# Altium schematic sheet Sheet1.SchDoc: SqueakyBoard
size A
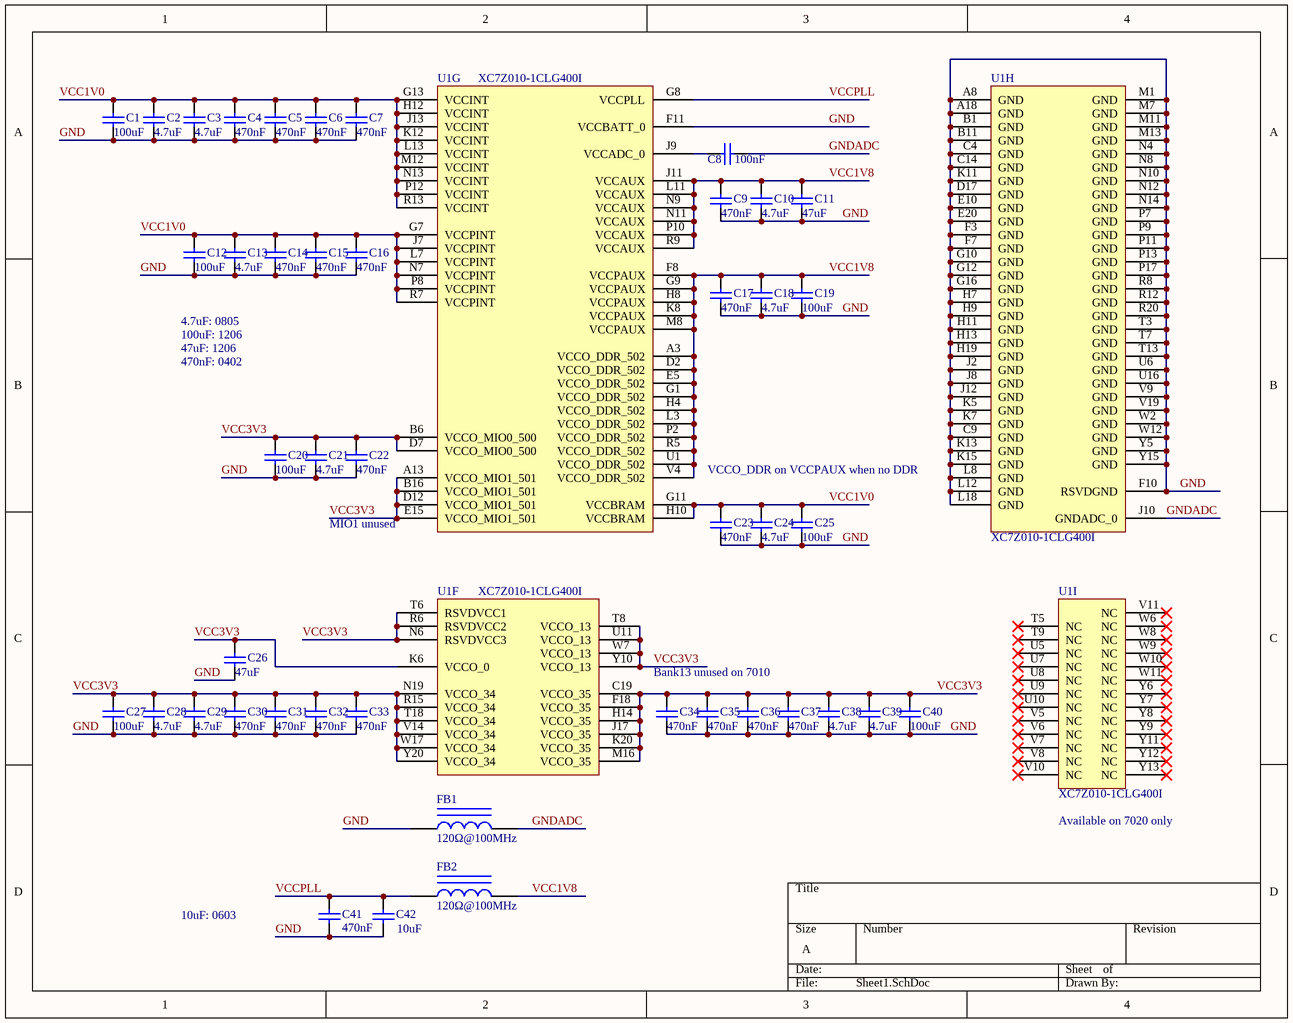
[diagram p0: Sheet1.SchDoc]

## Parts
C1  100uF  [1206_C]
C2  4.7uF  [0805_C]
C3  4.7uF  [0805_C]
C4  470nF  [0402_C]
C5  470nF  [0402_C]
C6  470nF  [0402_C]
C7  470nF  [0402_C]
C8  100nF  [1206_C]
C9  470nF  [0402_C]
C10  4.7uF  [0805_C]
C11  47uF  [1206_C]
C12  100uF  [1206_C]
C13  4.7uF  [0805_C]
C14  470nF  [0402_C]
C15  470nF  [0402_C]
C16  470nF  [0402_C]
C17  470nF  [0402_C]
C18  4.7uF  [0805_C]
C19  100uF  [1206_C]
C20  100uF  [1206_C]
C21  4.7uF  [0805_C]
C22  470nF  [0402_C]
C23  470nF  [0402_C]
C24  4.7uF  [0805_C]
C25  100uF  [1206_C]
C26  47uF  [1206_C]
C27  100uF  [1206_C]
C28  4.7uF  [0805_C]
C29  4.7uF  [0805_C]
C30  470nF  [0402_C]
C31  470nF  [0402_C]
C32  470nF  [0402_C]
C33  470nF  [0402_C]
C34  470nF  [0402_C]
C35  470nF  [0402_C]
C36  470nF  [0402_C]
C37  470nF  [0402_C]
C38  4.7uF  [0805_C]
C39  4.7uF  [0805_C]
C40  100uF  [1206_C]
C41  470nF  [0402_C]
C42  10uF  [0603_C]
FB1  120Ω@100MHz  [0805_L]
FB2  120Ω@100MHz  [0805_L]
U1  XC7Z010-1CLG400I  [CLG400]  (parts F,G,H,I of 9)

## Nets
GND: C1.2 C2.2 C3.2 C4.2 C5.2 C6.2 C7.2 C9.1 C10.1 C11.1 C12.2 C13.2 C14.2 C15.2 C16.2 C17.1 C18.1 C19.1 C20.2 C21.2 C22.2 C23.1 C24.1 C25.1 C26.1 C27.2 C28.2 C29.2 C30.2 C31.2 C32.2 C33.2 C34.2 C35.2 C36.2 C37.2 C38.2 C39.2 C40.2 C41.1 C42.1 FB1.1 U1.A8(GND) U1.A18(GND) U1.B1(GND) U1.B11(GND) U1.C4(GND) U1.C9(GND) U1.C14(GND) U1.D17(GND) U1.E10(GND) U1.E20(GND) U1.F3(GND) U1.F7(GND) U1.F10(RSVDGND) U1.F11(VCCBATT_0) U1.G10(GND) U1.G12(GND) U1.G16(GND) U1.H7(GND) U1.H9(GND) U1.H11(GND) U1.H13(GND) U1.H19(GND) U1.J2(GND) U1.J8(GND) U1.J12(GND) U1.K5(GND) U1.K7(GND) U1.K11(GND) U1.K13(GND) U1.K15(GND) U1.L8(GND) U1.L12(GND) U1.L18(GND) U1.M1(GND) U1.M7(GND) U1.M11(GND) U1.M13(GND) U1.N4(GND) U1.N8(GND) U1.N10(GND) U1.N12(GND) U1.N14(GND) U1.P7(GND) U1.P9(GND) U1.P11(GND) U1.P13(GND) U1.P17(GND) U1.R8(GND) U1.R12(GND) U1.R20(GND) U1.T3(GND) U1.T7(GND) U1.T13(GND) U1.U6(GND) U1.U16(GND) U1.V9(GND) U1.V19(GND) U1.W2(GND) U1.W12(GND) U1.Y5(GND) U1.Y15(GND)
GNDADC: C8.2 FB1.2 U1.J10(GNDADC_0)
VCC1V0: C1.1 C2.1 C3.1 C4.1 C5.1 C6.1 C7.1 C12.1 C13.1 C14.1 C15.1 C16.1 C23.2 C24.2 C25.2 U1.G7(VCCPINT) U1.G11(VCCBRAM) U1.G13(VCCINT) U1.H10(VCCBRAM) U1.H12(VCCINT) U1.J7(VCCPINT) U1.J13(VCCINT) U1.K12(VCCINT) U1.L7(VCCPINT) U1.L13(VCCINT) U1.M12(VCCINT) U1.N7(VCCPINT) U1.N13(VCCINT) U1.P8(VCCPINT) U1.P12(VCCINT) U1.R7(VCCPINT) U1.R13(VCCINT)
VCC1V8: C9.2 C10.2 C11.2 C17.2 C18.2 C19.2 FB2.2 U1.A3(VCCO_DDR_502) U1.D2(VCCO_DDR_502) U1.E5(VCCO_DDR_502) U1.F8(VCCPAUX) U1.G1(VCCO_DDR_502) U1.G9(VCCPAUX) U1.H4(VCCO_DDR_502) U1.H8(VCCPAUX) U1.J11(VCCAUX) U1.K8(VCCPAUX) U1.L3(VCCO_DDR_502) U1.L11(VCCAUX) U1.M8(VCCPAUX) U1.N9(VCCAUX) U1.N11(VCCAUX) U1.P2(VCCO_DDR_502) U1.P10(VCCAUX) U1.R5(VCCO_DDR_502) U1.R9(VCCAUX) U1.U1(VCCO_DDR_502) U1.V4(VCCO_DDR_502)
VCC3V3: C20.1 C21.1 C22.1 C26.2 C27.1 C28.1 C29.1 C30.1 C31.1 C32.1 C33.1 C34.1 C35.1 C36.1 C37.1 C38.1 C39.1 C40.1 U1.A13(VCCO_MIO1_501) U1.B6(VCCO_MIO0_500) U1.B16(VCCO_MIO1_501) U1.C19(VCCO_35) U1.D7(VCCO_MIO0_500) U1.D12(VCCO_MIO1_501) U1.E15(VCCO_MIO1_501) U1.F18(VCCO_35) U1.H14(VCCO_35) U1.J17(VCCO_35) U1.K6(VCCO_0) U1.K20(VCCO_35) U1.M16(VCCO_35) U1.N6(RSVDVCC3) U1.N19(VCCO_34) U1.R6(RSVDVCC2) U1.R15(VCCO_34) U1.T6(RSVDVCC1) U1.T8(VCCO_13) U1.T18(VCCO_34) U1.U11(VCCO_13) U1.V14(VCCO_34) U1.W7(VCCO_13) U1.W17(VCCO_34) U1.Y10(VCCO_13) U1.Y20(VCCO_34)
VCCPLL: C41.2 C42.2 FB2.1 U1.G8(VCCPLL)
NetC8_1: C8.1 U1.J9(VCCADC_0)

Not connected (* = marked no-connect by the designer): U1 T5(NC)* T9(NC)* U5(NC)* U7(NC)* U8(NC)* U9(NC)* U10(NC)* V5(NC)* V6(NC)* V7(NC)* V8(NC)* V10(NC)* V11(NC)* W6(NC)* W8(NC)* W9(NC)* W10(NC)* W11(NC)* Y6(NC)* Y7(NC)* Y8(NC)* Y9(NC)* Y11(NC)* Y12(NC)* Y13(NC)*

## Notes on the sheet
- 4.7uF: 0805
- 100uF: 1206
- 47uF: 1206
- 470nF: 0402
- VCCO_DDR on VCCPAUX when no DDR
- MIO1 unused
- Bank13 unused on 7010
- (near U1) Available on 7020 only
- 10uF: 0603
- Title
- Size:
- Date:
- A
- Number:
- Time:
- Revision:
- Sheet
- of
- File:

## Library data of the parts
C1 C11 C12 C19 C20 C25-C27 C40 = 1206 10uF (106) 10% 50V: 贴片电容; ComponentLink1Description: 供应商链接; ComponentLink1URL: http://www.szlcsc.com/product/details_14236.html; Package: 1206; Supplier: LC; SuppliersPartNumber: C13585
C2 C3 C10 C13 C18 C21 C24 C28 C29 C38 C39 = 0805 4.7uF (475) 10% 25V: 贴片电容; ComponentLink1Description: 供应商链接; ComponentLink1URL: http://www.szlcsc.com/product/details_2131.html; Package: 0805; Supplier: LC; SuppliersPartNumber: C1779
C4-C7 C9 C14-C17 C22 C23 C30-C37 C41 = 0402 470nF (474) 10% 10V: 贴片电容; ComponentLink1Description: 供应商链接; ComponentLink1URL: http://www.szlcsc.com/product/details_48344.html; Package: 0402; Supplier: LC; SuppliersPartNumber: C47339
C8 = 1206 100nF (104) 10% 50V: 贴片电容; ComponentLink1Description: 供应商链接; ComponentLink1URL: http://www.szlcsc.com/product/details_25237.html; Package: 1206; Supplier: LC; SuppliersPartNumber: C24497
C42 = 0603 10uF (106) 10% 10V: 贴片电容; ComponentLink1Description: 供应商链接; ComponentLink1URL: http://www.szlcsc.com/product/details_20411.html; Package: 0603; Supplier: LC; SuppliersPartNumber: C19702
FB1 FB2 = 0805 600Ω 25% 100MHz: 贴片磁珠; ComponentLink1Description: 供应商链接; ComponentLink1URL: http://www.szlcsc.com/product/details_1369.html; Package: 0805; Supplier: LC; SuppliersPartNumber: C1017
U1 = XC7Z010-1CLG400I: 667 MHz Zynq?7000 AP SoC, 130 PS I/O, 100 FPGA I/O, 400-Ball BGA, Speed Grade 1, Industrial Grade, Pb-Free; Manufacturer: Xilinx; Extensible Block RAM (# 36Kb Blocks): 240 KB (60); Flip Flops: 35200; LUTs: 17600; Speed Grade: -1; DatasheetVersion: v1.2; PackageVersion: Rev 1.1; PackageReference: CLG400; PackageDescription: Wire-Bond Chip-Scale BGA, Body 17 x 17 mm, 0.8 mm Pitch; Generic Part Number: XC7Z010; RoHS: Pb-Free; Mounting Technology: Surface Mount; Code_JEDEC: MO-275-MMAA-1; PartNumber: XC7Z010-1CLG400I; ComponentLink1Description: Datasheet; ComponentLink1URL: http://www.xilinx.com/support/documentation/data_sheets/ds190-Zynq-7000-Overview.pdf; ComponentLink2Description: Package Specification; ComponentLink2URL: http://www.xilinx.com/support/documentation/user_guides/ug865-Zynq-7000-Pkg-Pinout.pdf; ComponentLink3Description: DC and AC Switching Characteristics; ComponentLink3URL: http://www.xilinx.com/support/documentation/data_sheets/ds187-XC7Z010-XC7Z020-Data-Sheet.pdf; ComponentLink4Description: Package File; ComponentLink4URL: http://www.xilinx.com/support/packagefiles/z7packages/xc7z010clg400pkg.txt; ComponentLink5Description: Packaging and Pinout; ComponentLink5URL: http://www.xilinx.com/support/documentation/user_guides/ug865-Zynq-7000-Pkg-Pinout.pdf; ComponentLink6Description: PCB and Layout Guide; ComponentLink6URL: http://www.xilinx.com/support/documentation/user_guides/ug483_7Series_PCB.pdf